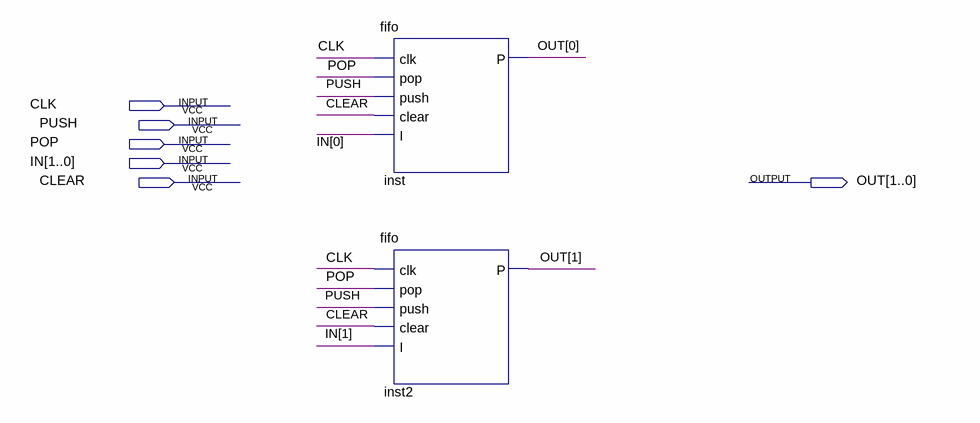
[diagram p0: schematic sheet]
// Quartus schematic fifo_two_bit.bdf as structural Verilog: 2 symbols, 6 pins
module fifo_two_bit (
  input  CLK,
  input  PUSH,
  input  POP,
  input  [1:0] IN,
  input  CLEAR,
  output [1:0] OUT
);

  fifo inst (.clk(CLK), .pop(POP), .push(PUSH), .clear(CLEAR), .I(IN[0]), .P(OUT[0]));
  fifo inst2 (.clk(CLK), .pop(POP), .push(PUSH), .clear(CLEAR), .I(IN[1]), .P(OUT[1]));
endmodule
